# Altium project Light Control - 6ports.PrjPcb
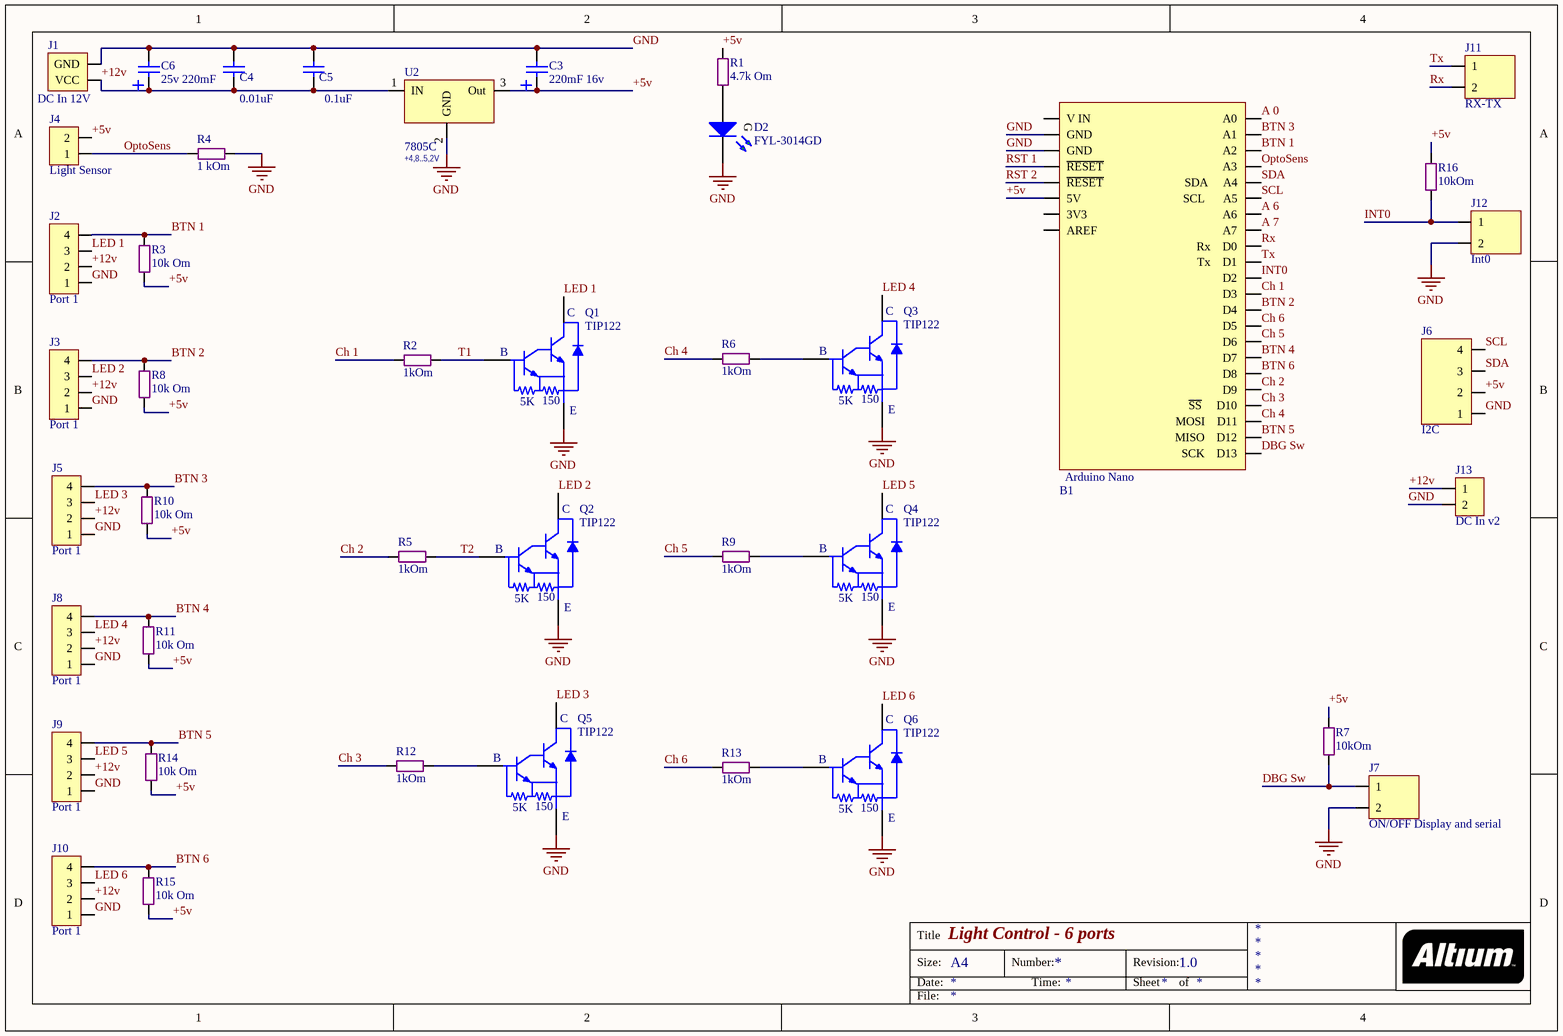
[diagram p0: Light Control - 6ports.SchDoc]
1 sheet, 42 parts. Net scope: global (net labels, ports and power ports of the same name join across sheets).
Board file: Light Control - 6ports.PcbDoc

## Sheet Light Control - 6ports.SchDoc: Light Control - 6 ports
size A4; Revision: 1.0

### Parts
B1  Arduino Nano  [Arduino Nano v3]  (value not drawn)
C3  220mF 16v  [Cap E p2mm D6.5xH11]
C4  0.01uF  [SMD 0805 (2012)]
C5  0.1uF  [SMD 0805 (2012)]
C6  25v 220mF  [Cap E p2mm D6.5xH11]
D2  FYL-3014GD  [LED Round 3mm Green]
J1  DC In 12V  [DC Connector]
J2  Port 1  [Molex Micro-Fit 3.0 - 4 pin D R]
J3  Port 1  [Molex Micro-Fit 3.0 - 4 pin D R]
J4  Light Sensor  [Molex Micro-Fit 3.0 - 2 pin D R]
J5  Port 1  [Molex Micro-Fit 3.0 - 4 pin D R]
J6  I2C  [Line 2.54 X 4]
J7  ON/OFF Display and serial  [Line 2.54 x 2]
J8  Port 1  [Molex Micro-Fit 3.0 - 4 pin D R]
J9  Port 1  [Molex Micro-Fit 3.0 - 4 pin D R]
J10  Port 1  [Molex Micro-Fit 3.0 - 4 pin D R]
J11  RX-TX  [Line 2.54 x 2]
J12  Int0  [Line 2.54 x 2]
J13  DC In v2  [DG301 5mm 2p]
Q1  TIP122  [TO220-2]
Q2  TIP122  [TO220-2]
Q3  TIP122  [TO220-2]
Q4  TIP122  [TO220-2]
Q5  TIP122  [TO220-2]
Q6  TIP122  [TO220-2]
R1  4.7k Om  [SMD 0805 (2012)]
R2  1kOm  [SMD 1206 (3216)]
R3  10k Om  [Res p7.62 (4p) 0.25w]
R4  1 kOm  [SMD 0805 (2012)]
R5  1kOm  [SMD 0805 (2012)]
R6  1kOm  [SMD 0805 (2012)]
R7  10kOm  [SMD 0805 (2012)]
R8  10k Om  [SMD 0805 (2012)]
R9  1kOm  [SMD 0805 (2012)]
R10  10k Om  [SMD 0805 (2012)]
R11  10k Om  [Res p7.62 (4p) 0.25w]
R12  1kOm  [SMD 0805 (2012)]
R13  1kOm  [SMD 0805 (2012)]
R14  10k Om  [Res p7.62 (4p) 0.25w]
R15  10k Om  [Res p7.62 (4p) 0.25w]
R16  10kOm  [SMD 0805 (2012)]
U2  7805C  V Out: +4,8..5,2V  [D-PAK]

### Nets
GND: B1.Gnd1(GND) B1.Gnd2(GND) C3.2 C4.1 C5.1 C6.2 D2.K J1.GND J2.1 J3.1 J5.1 J6.1 J7.2 J8.1 J9.1 J10.1 J12.2 J13.2 Q1.3(E) Q2.3(E) Q3.3(E) Q4.3(E) Q5.3(E) Q6.3(E) R4.2 U2.2(GND)
+5v: B1.5V C3.1 J4.2 J6.2 R1.1 R3.2 R7.2 R8.2 R10.2 R11.2 R14.2 R15.2 R16.2 U2.3(Out)
+12v: C4.2 C5.2 C6.1 J1.VCC J2.2 J3.2 J5.2 J8.2 J9.2 J10.2 J13.1 U2.1(IN)
A 0: B1.A0
A 6: B1.A6
A 7: B1.A7
BTN 1: B1.A2 J2.4 R3.1
BTN 2: B1.D4 J3.4 R8.1
BTN 3: B1.A1 J5.4 R10.1
BTN 4: B1.D7 J8.4 R11.1
BTN 5: B1.D12(MISO____D12) J9.4 R14.1
BTN 6: B1.D8 J10.4 R15.1
Ch 1: B1.D3 R2.1
Ch 2: B1.D9 R5.1
Ch 3: B1.D10(~{SS}_____D10) R12.1
Ch 4: B1.D11(MOSI____D11) R6.1
Ch 5: B1.D6 R9.1
Ch 6: B1.D5 R13.1
DBG Sw: B1.D13(SCK____D13) J7.1 R7.1
INT0: B1.D2 J12.1 R16.1
LED 1: J2.3 Q1.2(C)
LED 2: J3.3 Q2.2(C)
LED 3: J5.3 Q5.2(C)
LED 4: J8.3 Q3.2(C)
LED 5: J9.3 Q4.2(C)
LED 6: J10.3 Q6.2(C)
OptoSens: B1.A3 J4.1 R4.1
RST 1: B1.Rst1(~{RESET})
RST 2: B1.Rst2(~{RESET})
Rx: B1.D0(Rx____D0) J11.2
SCL: B1.A5(SCL______A5) J6.4
SDA: B1.A4(SDA_____A4) J6.3
T1: Q1.1(B) R2.2
T2: Q2.1(B) R5.2
Tx: B1.D1(Tx____D1) J11.1
NetD2_A: D2.A R1.2
NetQ3_1: Q3.1(B) R6.2
NetQ4_1: Q4.1(B) R9.2
NetQ5_1: Q5.1(B) R12.2
NetQ6_1: Q6.1(B) R13.2

Not connected (* = marked no-connect by the designer): B1 3V3 Aref(AREF) Vin(V_IN)

### Notes on the sheet
- Title
- Size:
- Date:
- A4
- Number:
- Time:
- Revision:
- Sheet
- of
- File:
- (in symbol Led Round 3mm Green) G
- (in symbol TIP122) 5K; 150

### Library data of the parts
C3 = Cap E 220mF x 16V: Capacitor; Value: 220mF 16v
C4 C5 = Cap SMD 0402-1812: Capacitor
C6 = Cap E 220mF x 16V: Capacitor; Value: 220mF 16v
D2 = Led Round 3mm Green: 2.1v 10mA, 15-30mCd; Forward Voltage Max: 2.3; Forward Voltage TYP: 2.1; Wave len min/typ: 570nm; Liminous Typ (mcd): 15-30; Forward Amp (mA): 10; Color: Green; Name: FYL-3014GD
J1 = DC Connector (PJ-002B): DC Connector; Ext Pin Diameter: 5.5mm; Int Pin Diameter: 2.5
J2 J3 J5 J8-J10 = Micro-Fit 4R (2x2): Horisontal, Dbl line, Male - 3mm; Part Number: 0430450402; Name: Micro-Fit 3.0; URL: http://www.molex.com/molex/products/datasheet.jsp?part=active/0430450402_PCB_HEADERS.xml
J4 = Micro-Fit 2R (1x2): Horisontal, Dbl line, Male - 3mm; Part Number: 430450200; Name: Micro-Fit 3.0; URL: http://www.molex.com/molex/products/datasheet.jsp?part=active/0430450200_PCB_HEADERS.xml
J6 = PLS-4: Vert, Sgl line, Male
J7 J11 J12 = PLS-2: Vert, Sgl line, Male
J13 = DG301-5.0-2P12: DG301 series
Q1-Q6 = TIP122: NPN Darlington 5A, 65W, 100V, h>1000; I imp: 8A; h21e: >1000; Code_JEDEC: TO-220; U max: 100V; I max: 5A; P max: 65W; Channnel: NPN
R1-R16 = Res All Types
U2 = 7805C: Voltage Regulator; Manufacturer: Интеграл; I output (A): 1; Max Voltage In (V): 35; Напряжение выход-вход (dropout): >2V; t: -10..+70°C; Case: D2PAK; Shema: http://tec.org.ru/_bd/5/57349922.jpg; Name: 7805C